# EAGLE schematic quantik (EAGLE 7.4.0)
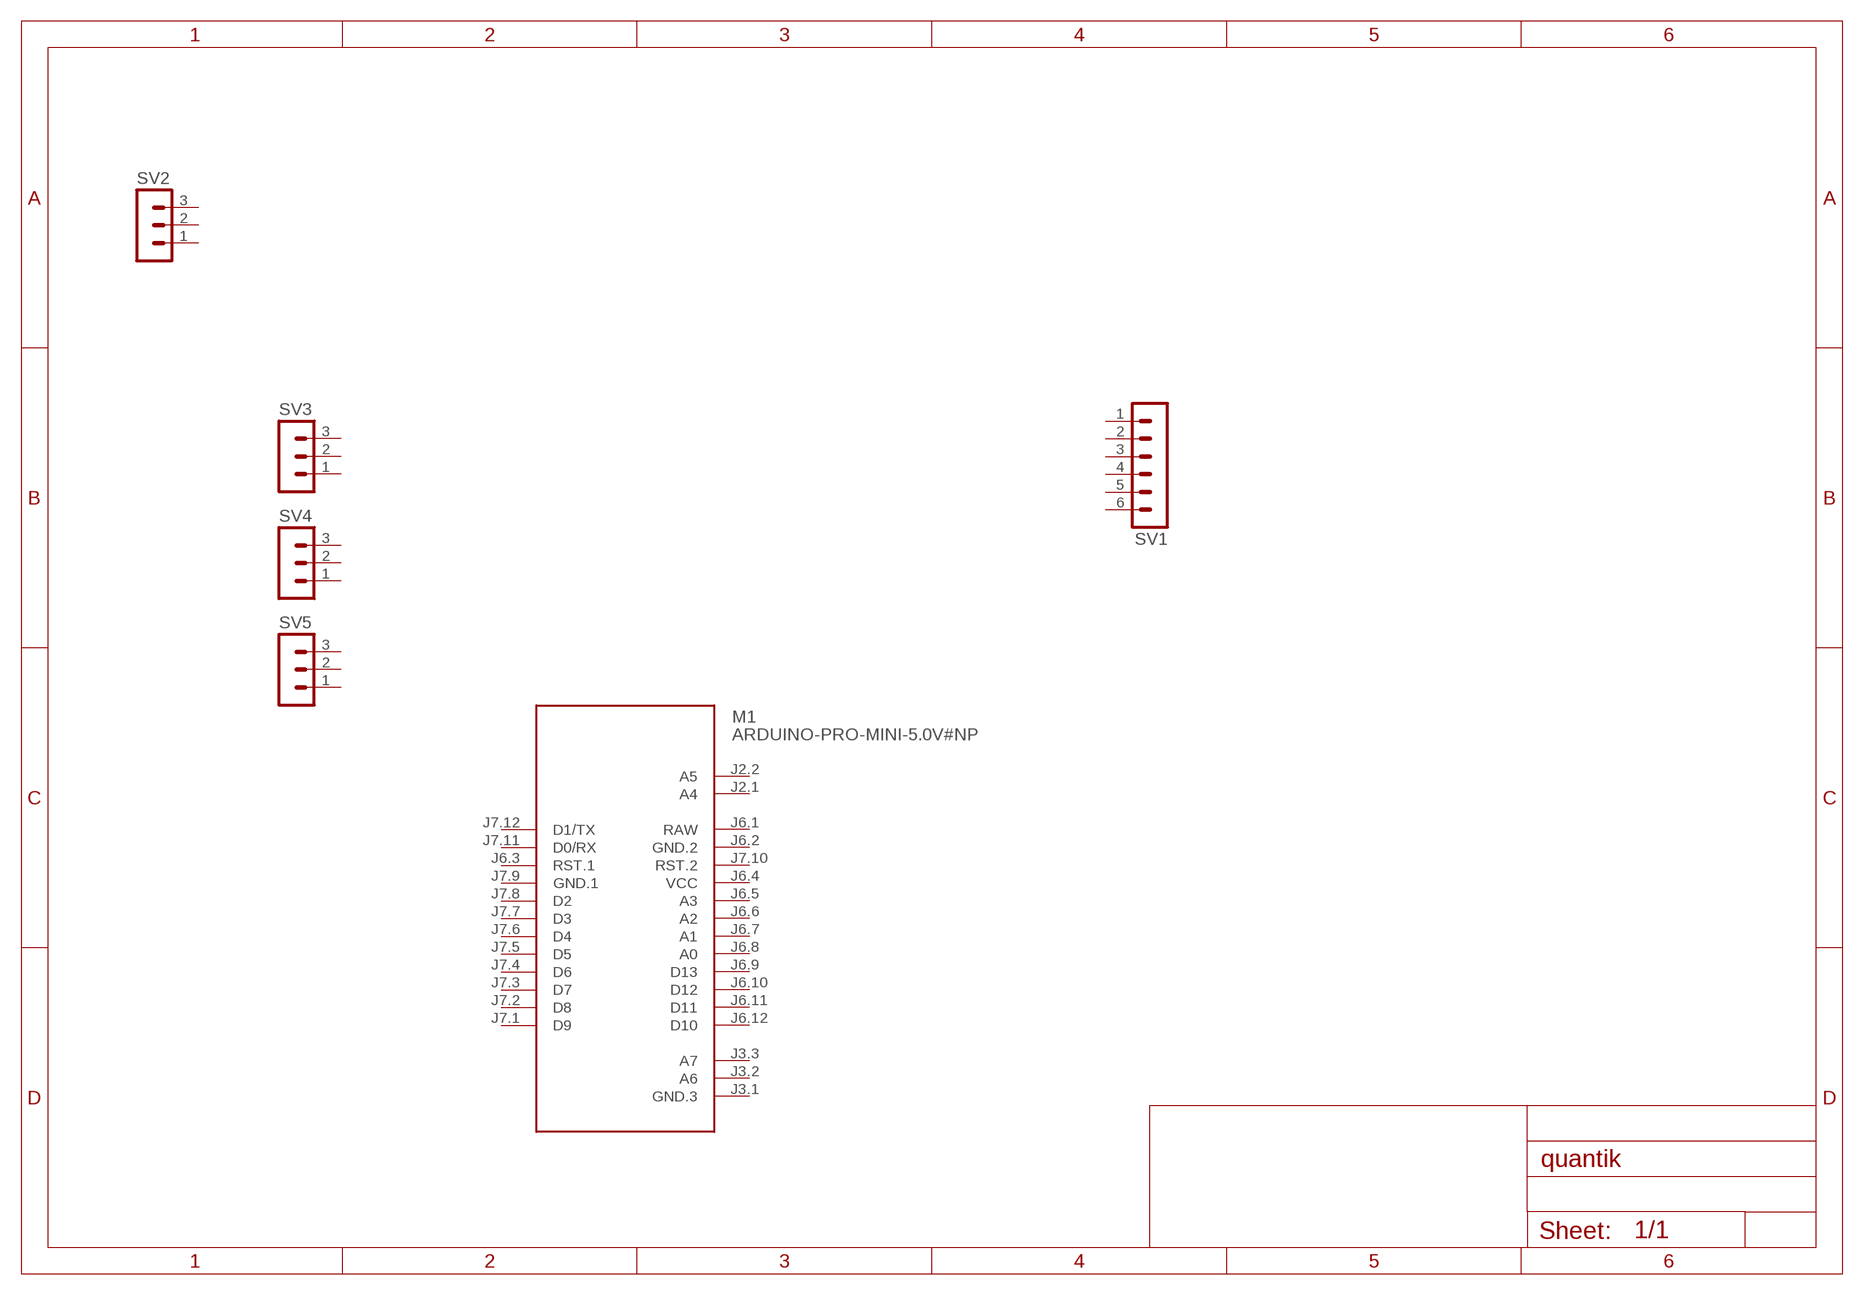
[diagram p0: schematic, sheet 1]

## Parts
M1  ARDUINO-PRO-MINI-5.0V#NP  [ARDUINO-PRO-MINI#NP]
SV1  MA06-1  [MA06-1]
SV2  MA03-1  [MA03-1]
SV3  MA03-1  [MA03-1]
SV4  MA03-1  [MA03-1]
SV5  MA03-1  [MA03-1]
Unconnected: M1.J2.1(A4) M1.J2.2(A5) M1.J3.1(GND.3) M1.J3.2(A6) M1.J3.3(A7) M1.J6.3(RST.1) M1.J6.5(A3) M1.J6.6(A2) M1.J6.7(A1) M1.J6.8(A0) M1.J6.9(D13) M1.J6.10(D12) M1.J6.11(D11) M1.J6.12(D10) M1.J7.1(D9) M1.J7.2(D8) M1.J7.3(D7) M1.J7.4(D6) M1.J7.5(D5) M1.J7.6(D4) M1.J7.7(D3) M1.J7.8(D2) M1.J7.10(RST.2) M1.J7.11(D0/RX) M1.J7.12(D1/TX) SV1.1 SV1.2 SV1.3 SV1.4 SV1.5 SV1.6 SV2.1 SV2.2 SV2.3 SV3.1 SV3.2 SV3.3 SV4.1 SV4.2 SV4.3 SV5.1 SV5.2 SV5.3

## Power pins joined to a net without a drawn wire
GND.1: M1.J7.9(GND.1)
GND.2: M1.J6.2(GND.2)
RAW: M1.J6.1(RAW)
VCC: M1.J6.4(VCC)

## Library data of the parts
M1 = diy-modules:ARDUINO-PRO-MINI-*#NP: Arduino Pro Mini (and compatible devices) without programming pads More details available here: https://www.arduino.cc/en/Main/ArduinoBoardProMini Click here to find device on ebay.com <http://www.ebay.com/sch/arduino+pro+mini>
SV1 = con-lstb:MA06-1: PIN HEADER; OC_FARNELL: unknown; OC_NEWARK: unknown
SV2-SV5 = con-lstb:MA03-1: PIN HEADER; OC_FARNELL: unknown; OC_NEWARK: unknown